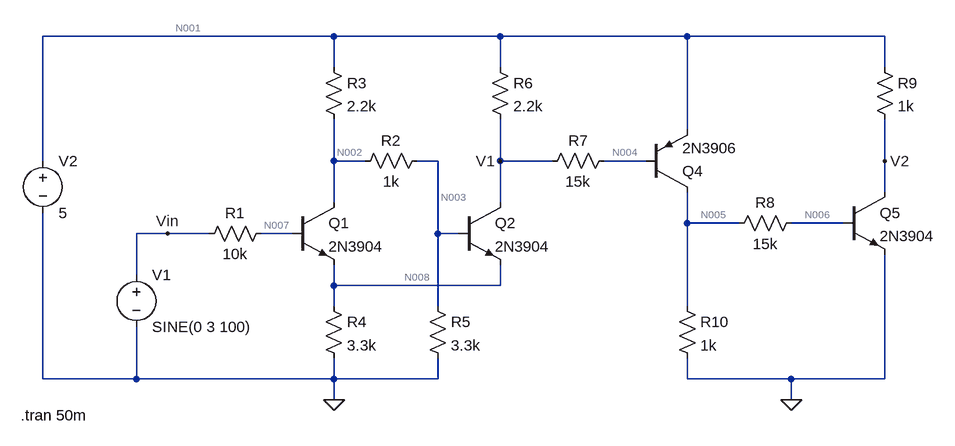
[diagram p0: schematic Schmitt Trigger Example.asc]
Schmitt Trigger Example.asc, the LTspice schematic file:
Version 4
SHEET 1 1264 680
WIRE 192 -128 -256 -128
WIRE 448 -128 192 -128
WIRE 736 -128 448 -128
WIRE 1040 -128 736 -128
WIRE 192 -80 192 -128
WIRE 448 -80 448 -128
WIRE 1040 -80 1040 -128
WIRE 736 16 736 -128
WIRE -256 64 -256 -128
WIRE 192 64 192 0
WIRE 240 64 192 64
WIRE 352 64 320 64
WIRE 448 64 448 0
WIRE 528 64 448 64
WIRE 672 64 608 64
WIRE 1040 64 1040 0
WIRE 1040 112 1040 64
WIRE 192 128 192 64
WIRE 448 128 448 64
WIRE 736 160 736 112
WIRE 816 160 736 160
WIRE 976 160 896 160
WIRE -64 176 -112 176
WIRE 0 176 -64 176
WIRE 128 176 80 176
WIRE 352 176 352 64
WIRE 384 176 352 176
WIRE -112 240 -112 176
WIRE 192 256 192 224
WIRE 448 256 448 224
WIRE 448 256 192 256
WIRE 192 288 192 256
WIRE 352 288 352 176
WIRE 736 288 736 160
WIRE -256 400 -256 144
WIRE -112 400 -112 320
WIRE -112 400 -256 400
WIRE 192 400 192 368
WIRE 192 400 -112 400
WIRE 352 400 352 368
WIRE 352 400 192 400
WIRE 736 400 736 368
WIRE 896 400 736 400
WIRE 1040 400 1040 208
WIRE 1040 400 896 400
WIRE 192 432 192 400
WIRE 896 432 896 400
FLAG 192 432 0
FLAG 896 432 0
FLAG 448 64 V1
FLAG 1040 64 V2
FLAG -64 176 Vin
SYMBOL res 96 160 R90
WINDOW 0 0 56 VBottom 2
WINDOW 3 32 56 VTop 2
SYMATTR InstName R1
SYMATTR Value 10k
SYMBOL npn 128 128 R0
SYMATTR InstName Q1
SYMATTR Value 2N3904
SYMBOL res 336 48 R90
WINDOW 0 0 56 VBottom 2
WINDOW 3 32 56 VTop 2
SYMATTR InstName R2
SYMATTR Value 1k
SYMBOL npn 384 128 R0
SYMATTR InstName Q2
SYMATTR Value 2N3904
SYMBOL res 176 -96 R0
SYMATTR InstName R3
SYMATTR Value 2.2k
SYMBOL res 176 272 R0
SYMATTR InstName R4
SYMATTR Value 3.3k
SYMBOL res 336 272 R0
SYMATTR InstName R5
SYMATTR Value 3.3k
SYMBOL res 432 -96 R0
SYMATTR InstName R6
SYMATTR Value 2.2k
SYMBOL voltage -112 224 R0
WINDOW 123 0 0 Left 0
WINDOW 39 0 0 Left 0
SYMATTR InstName V1
SYMATTR Value SINE(0 3 100)
SYMBOL voltage -256 48 R0
WINDOW 123 0 0 Left 0
WINDOW 39 0 0 Left 0
SYMATTR InstName V2
SYMATTR Value 5
SYMBOL pnp 672 112 M180
SYMATTR InstName Q4
SYMATTR Value 2N3906
SYMBOL res 624 48 R90
WINDOW 0 0 56 VBottom 2
WINDOW 3 32 56 VTop 2
SYMATTR InstName R7
SYMATTR Value 15k
SYMBOL res 912 144 R90
WINDOW 0 0 56 VBottom 2
WINDOW 3 32 56 VTop 2
SYMATTR InstName R8
SYMATTR Value 15k
SYMBOL npn 976 112 R0
SYMATTR InstName Q5
SYMATTR Value 2N3904
SYMBOL res 1024 -96 R0
SYMATTR InstName R9
SYMATTR Value 1k
SYMBOL res 720 272 R0
SYMATTR InstName R10
SYMATTR Value 1k
TEXT -290 456 Left 2 !.tran 50m

The netlist it stands for:
* Schmitt Trigger Example.asc
R1 N007 Vin 10k
Q1 N002 N007 N008 0 2N3904
R2 N003 N002 1k
Q2 V1 N003 N008 0 2N3904
R3 N001 N002 2.2k
R4 N008 0 3.3k
R5 N003 0 3.3k
R6 N001 V1 2.2k
V1 Vin 0 SINE(0 3 100)
V2 N001 0 5
Q4 N005 N004 N001 0 2N3906
R7 N004 V1 15k
R8 N006 N005 15k
Q5 V2 N006 0 0 2N3904
R9 N001 V2 1k
R10 N005 0 1k
.model NPN NPN
.model PNP PNP
.lib standard.bjt
.tran 50m
.backanno
.end

* Results of the author's LTspice run, read from the files saved beside the schematic
* Operating Point, zero values left out:
*   V(n007) = 52.03 nV
*   V(n002) = 3.306 V
*   V(n008) = 1.895 V
*   V(n003) = 2.535 V
*   V(v1) = 3.812 V
*   V(n001) = 5 V
*   V(n005) = 4.861 V
*   V(n004) = 4.301 V
*   V(n006) = 709 mV
*   V(v2) = 48.24 mV
*   Ic(Q4) = -5.137 mA
*   Ib(Q4) = -32.55 µA
*   Ie(Q4) = 5.17 mA
*   Ic(Q5) = 4.952 mA
*   Ib(Q5) = 276.8 µA
*   Ie(Q5) = -5.229 mA
*   Ic(Q2) = 572.3 µA
*   Ib(Q2) = 1.886 µA
*   Ie(Q2) = -574.2 µA
*   Ic(Q1) = 3.304 pA
*   Ib(Q1) = -5.203 pA
*   Ie(Q1) = 1.896 pA
*   I(R10) = 4.861 mA
*   I(R9) = 4.952 mA
*   I(R8) = -276.8 µA
*   I(R7) = 32.55 µA
*   I(R6) = 539.8 µA
*   I(R5) = 768.3 µA
*   I(R4) = 574.2 µA
*   I(R3) = 770.2 µA
*   I(R2) = -770.2 µA
*   I(R1) = 5.203 pA
*   I(V2) = -11.43 mA
*   I(V1) = 5.203 pA
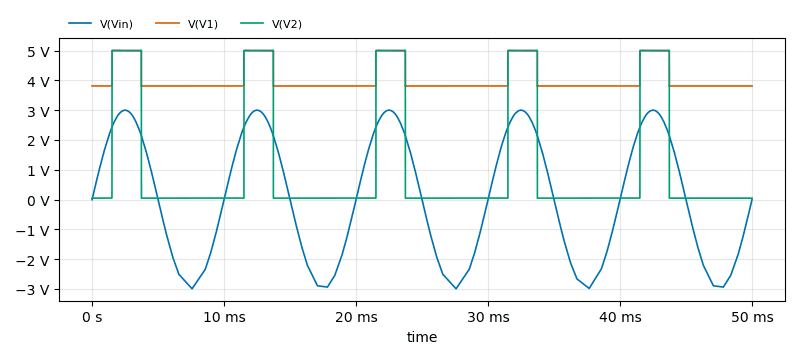
[diagram p1: Transient Analysis of Schmitt Trigger Example.asc, plotted from the saved traces]
* Transient Analysis, 1 run:
*   V(Vin): min -2.994 V, max 3 V, average 15.52 mV, rms 2.108 V, last 0 V
*   V(V1): min 3.804 V, max 5 V, average 4.077 V, rms 4.107 V, last 3.813 V
*   V(V2): min 48.23 mV, max 5.007 V, average 1.15 V, rms 2.359 V, last 48.24 mV